# Altium schematic sheet ArbPwrBoost_P5.SchDoc: =ProjectTitle
size B; Engineer: Hab Collector; Organization: Altium Limited; Address1: 3621 Gin Way; Address2: Snellville, GA 30039; SheetNumber: 5; SheetTotal: 7
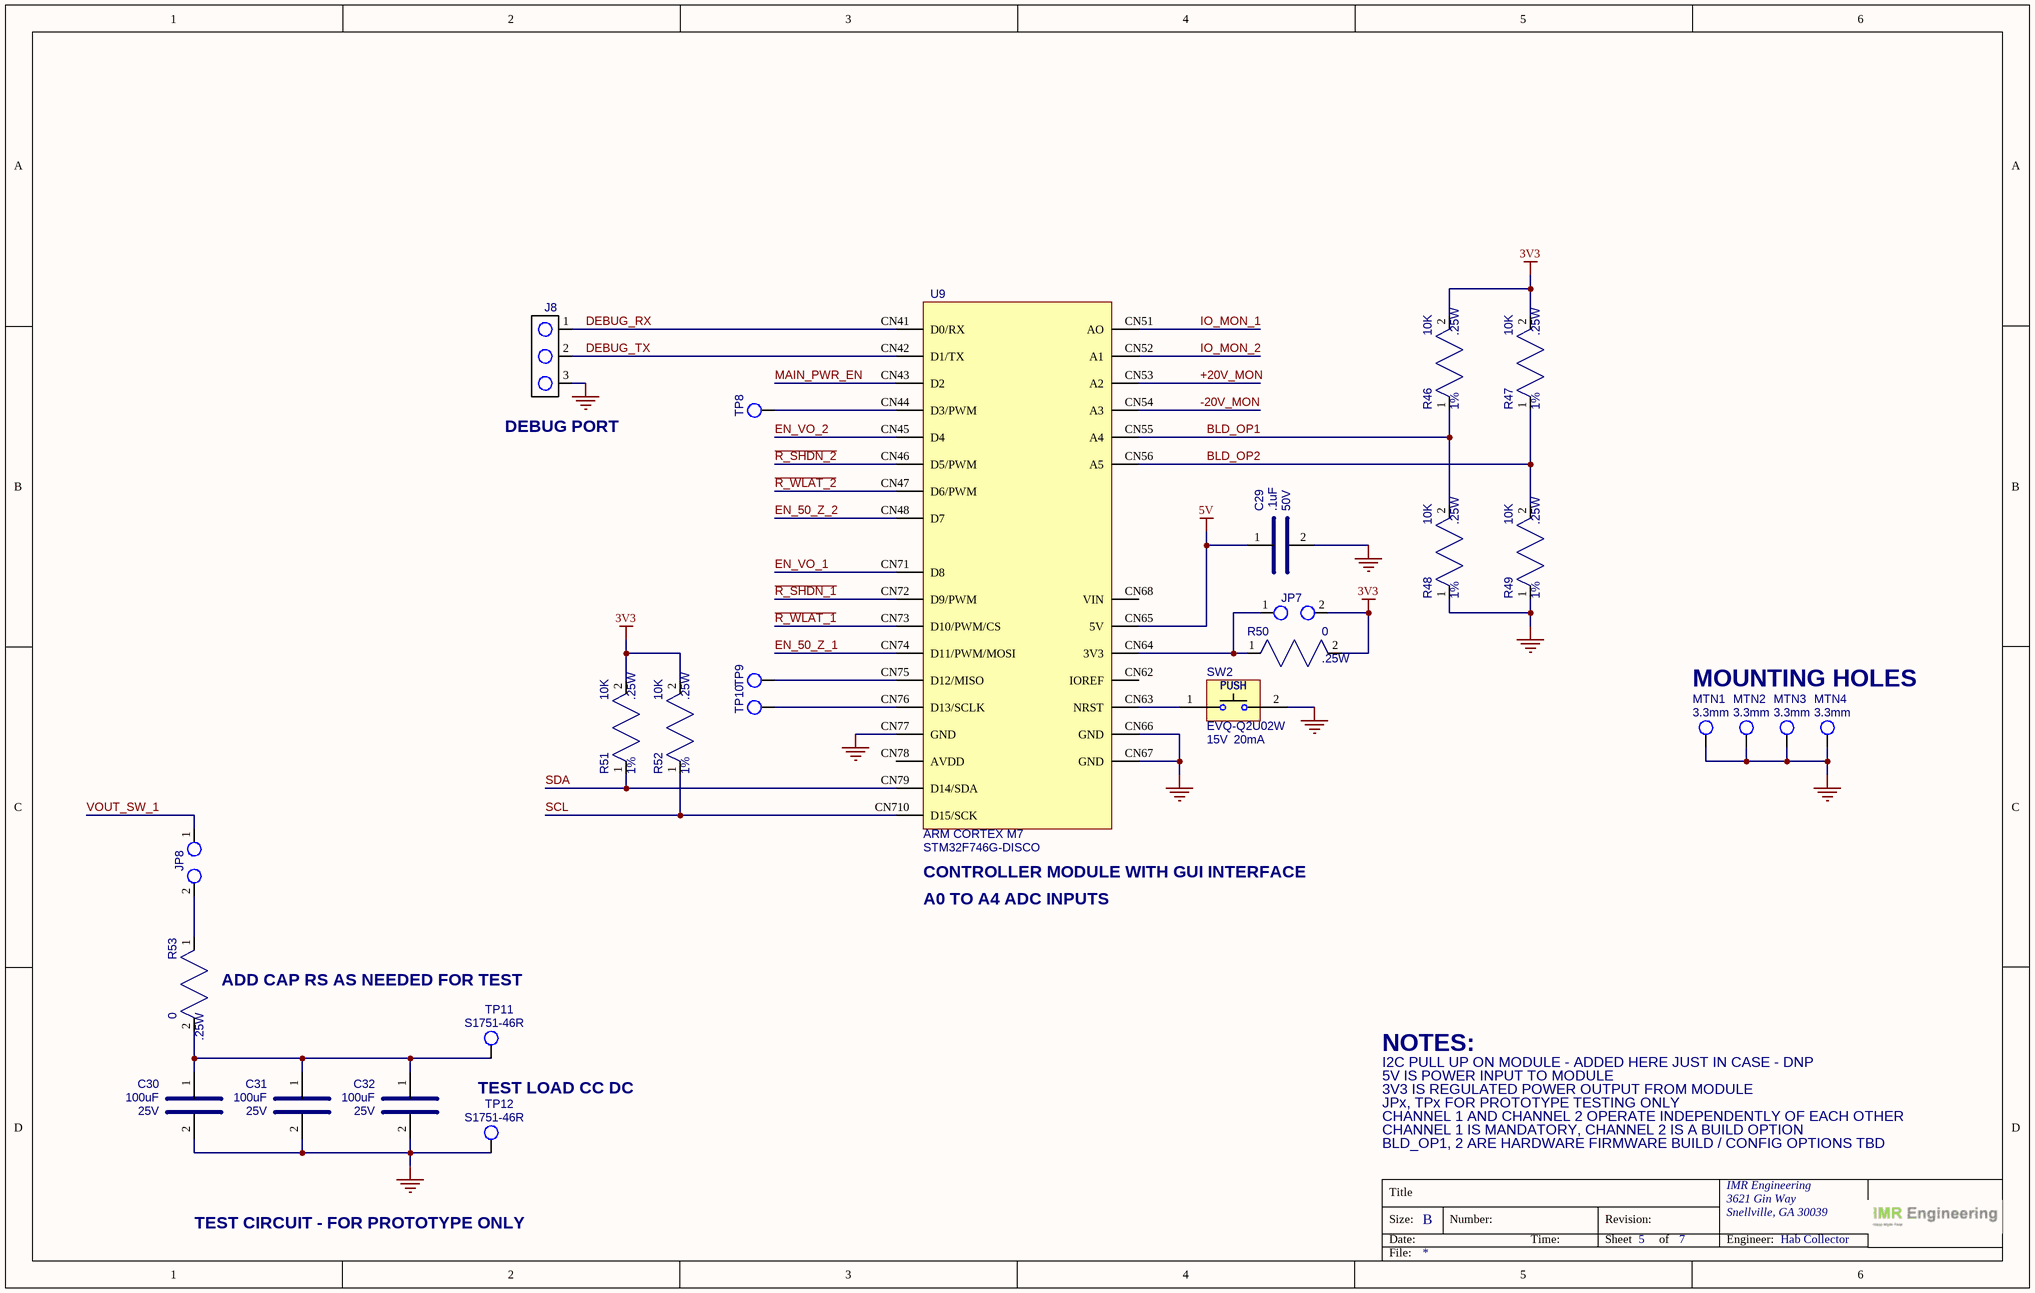
[diagram p0: ArbPwrBoost_P5.SchDoc]

## Parts
C29  value .1uF  Voltage: 50V  [CAP_0805]  (hidden comment: KGM21NR71H104KT)
C30  value 100uF  Voltage: 25V  [CAPC6153X670N]  (hidden comment: KCM55WC71E107MH13L)
C31  value 100uF  Voltage: 25V  [CAPC6153X670N]  (hidden comment: KCM55WC71E107MH13L)
C32  value 100uF  Voltage: 25V  [CAPC6153X670N]  (hidden comment: KCM55WC71E107MH13L)
J8  PREC003SFAN-RC  [HDR_1X3_100MILL]  (value not drawn)
JP7  PREC002SFAN-RC  [HDR_1X2_100MILL]  (value not drawn)
JP8  PREC002SFAN-RC  [HDR_1X2_100MILL]  (value not drawn)
MTN1  Hole Size: 3.3mm  [PMG_MT_HOLE_3.3MM]  (no BOM)
MTN2  Hole Size: 3.3mm  [PMG_MT_HOLE_3.3MM]  (no BOM)
MTN3  Hole Size: 3.3mm  [PMG_MT_HOLE_3.3MM]  (no BOM)
MTN4  Hole Size: 3.3mm  [PMG_MT_HOLE_3.3MM]  (no BOM)
R46  value 10K  Power: .25W  Tolerance: 1%  [RES_0805]  (hidden comment: RC0805FR-7W10KL)
R47  value 10K  Power: .25W  Tolerance: 1%  [RES_0805]  (hidden comment: RC0805FR-7W10KL)
R48  value 10K  Power: .25W  Tolerance: 1%  [RES_0805]  (hidden comment: RC0805FR-7W10KL)
R49  value 10K  Power: .25W  Tolerance: 1%  [RES_0805]  (hidden comment: RC0805FR-7W10KL)
R50  value 0  Power: .25W  [RES_0805]  (hidden comment: RC0805JR-070RL)
R51  value 10K  Power: .25W  Tolerance: 1%  [RES_0805]  (hidden comment: RC0805FR-7W10KL)
R52  value 10K  Power: .25W  Tolerance: 1%  [RES_0805]  (hidden comment: RC0805FR-7W10KL)
R53  value 0  Power: .25W  [RES_0805]  (hidden comment: RC0805JR-070RL)
SW2  value 15V  Current: 20mA  [PANASONIC_EVQ-Q2U02W]  (hidden comment: EVQ-Q2U02W)
TP8  (no value)  [TEST_POINT_20MIL_TH]  (no BOM)
TP9  (no value)  [TEST_POINT_20MIL_TH]  (no BOM)
TP10  (no value)  [TEST_POINT_20MIL_TH]  (no BOM)
TP11  S1751-46R  [HARWIN_S1751]
TP12  S1751-46R  [HARWIN_S1751]
U9  value ARM CORTEX M7  [STM32F746G-DISCO]  (hidden comment: STM32F746G-DISCO)

## Nets
3V3: JP7.2 R46.2 R47.2 R50.2 R51.2 R52.2
5V: C29.1 U9.CN65(5V)
GND: C29.2 C30.2 C31.2 C32.2 J8.3 MTN1.1 MTN2.1 MTN3.1 MTN4.1 R48.1 R49.1 SW2.2(B') TP12.1 U9.CN66(GND) U9.CN67(GND) U9.CN77(GND)
+20V_MON: U9.CN53(A2)
-20V_MON: U9.CN54(A3)
~{R_SHDN_1}: U9.CN72(D9/PWM)
~{R_SHDN_2}: U9.CN46(D5/PWM)
~{R_WLAT_1}: U9.CN73(D10/PWM/CS)
~{R_WLAT_2}: U9.CN47(D6/PWM)
BLD_OP1: R46.1 R48.2 U9.CN55(A4)
BLD_OP2: R47.1 R49.2 U9.CN56(A5)
DEBUG_RX: J8.1 U9.CN41(D0/RX)
DEBUG_TX: J8.2 U9.CN42(D1/TX)
EN_50_Z_1: U9.CN74(D11/PWM/MOSI)
EN_50_Z_2: U9.CN48(D7)
EN_VO_1: U9.CN71(D8)
EN_VO_2: U9.CN45(D4)
IO_MON_1: U9.CN51(AO)
IO_MON_2: U9.CN52(A1)
MAIN_PWR_EN: U9.CN43(D2)
SCL: R52.1 U9.CN710(D15/SCK)
SDA: R51.1 U9.CN79(D14/SDA)
VOUT_SW_1: JP8.1
NetC30_1: C30.1 C31.1 C32.1 R53.2 TP11.1
NetJP7_1: JP7.1 R50.1 U9.CN64(3V3)
NetJP8_2: JP8.2 R53.1
NetSW2_1: SW2.1(B) U9.CN63(NRST)
NetTP8_1: TP8.1 U9.CN44(D3/PWM)
NetTP9_1: TP9.1 U9.CN75(D12/MISO)
NetTP10_1: TP10.1 U9.CN76(D13/SCLK)

Not connected (* = marked no-connect by the designer): U9 CN62(IOREF) CN68(VIN) CN78(AVDD)

## Notes on the sheet
- (near J8) DEBUG PORT
- MOUNTING HOLES
- (near U9) CONTROLLER MODULE WITH GUI INTERFACE
- A0 TO A4 ADC INPUTS
- (near R53) ADD CAP RS AS NEEDED FOR TEST
- TEST LOAD CC DC
- I2C PULL UP ON MODULE - ADDED HERE JUST IN CASE - DNP
- NOTES:
- 5V IS POWER INPUT TO MODULE
- 3V3 IS REGULATED POWER OUTPUT FROM MODULE
- JPx, TPx FOR PROTOTYPE TESTING ONLY
- CHANNEL 1 IS MANDATORY, CHANNEL 2 IS A BUILD OPTION
- CHANNEL 1 AND CHANNEL 2 OPERATE INDEPENDENTLY OF EACH OTHER
- BLD_OP1, 2 ARE HARDWARE FIRMWARE BUILD / CONFIG OPTIONS TBD
- TEST CIRCUIT - FOR PROTOTYPE ONLY
- Title
- Size:
- Date:
- B
- Number:
- Time:
- Revision:
- Sheet
- of
- IMR Engineering
- Engineer:
- File:
- (in symbol SWITCH_EVQ-Q2U02W) PUSH

## Library data of the parts
C29 = CAP_SMD_0.1UF_50V_0805: CAP CER 0.1UF 50V X7R 0805; MFG: KYOCERA AVX; Case/Package: 0805; MFG_PN: KGM21NR71H104KT; Supplier 1: DigiKey; Supplier Part Number 1: 478-KGM21NR71H104KTCT-ND; Unit Price: .1
C30-C32 = CAP_SMD_100UF_25V_SMD: CAP CER 100UF 25V X7S SMD; MFG: Murata Electronics; Case/Package: CAPC6153X670N; MFG_PN: KCM55WC71E107MH13L; Supplier 1: DigiKey; Supplier Part Number 1: 490-KCM55WC71E107MH13LCT-ND; Unit Price: 5.68
J8 = CONN_HEADER_3P_100MIL_VERT: CONN HEADER VERT 3POS 2.54MM; MFG: Sullins Connector Solutions; Case/Package: 2P_2.54MM; MFG_PN: PREC003SFAN-RC; Supplier 1: Digi-Key; Supplier Part Number 1: S1212EC-03-ND; Value: *; Unit Price: .07
JP7 JP8 = CONN_JUMPER_2P_100MIL_VERT: CONN HEADER VERT 2POS 2.54MM; MFG: Sullins Connector Solutions; Case/Package: 2P_2.54MM; MFG_PN: PREC002SFAN-RC; Supplier 1: Digi-Key; Supplier Part Number 1: S1212EC-02-ND; Value: *; Unit Price: .07
MTN1-MTN4 = MTN_HOLE_3.3MM: MOUNTING HOLE 3.3MM
R46-R49 R51 R52 = RES_SMD_10K_0805_1/4W_1%: RES SMD 10K OHM 1% 1/4W 0805; MFG: Yageo; Case/Package: 0805; MFG_PN: RC0805FR-7W10KL; Supplier 1: DigiKey; Supplier Part Number 1: 13-RC0805FR-7W10KLCT-ND; Unit Price: .10
R50 R53 = RES_SMD_0_0805_1/8W_1%: RES SMD 0 OHM 1% 1/8W 0805; MFG: Yageo; Case/Package: 0805; MFG_PN: RC0805JR-070RL; Supplier 1: DigiKey; Supplier Part Number 1: 311-0.0ARCT-ND; Unit Price: .1; Tolerance: 1%
SW2 = SWITCH_EVQ-Q2U02W: SWITCH TACTILE SPST-NO 0.02A 15V; MFG: American Zettler; Case/Package: EVQQ2; Supplier 1: DigiKey; Supplier Part Number 1: P12954SCT-ND; Unit Price: .25; MFG_PN: EVQ-Q2U02W
TP8-TP10 = CONN_TEST_POINT_TH_PAD_20MIL: TEST POINT TH 20MIL HOLE
TP11 TP12 = CONN_TEST_POINT_S1751-46R: PCB TEST POINT CONNECT; MFG: Harwin Inc; Case/Package: S1751; MFG_PN: S1751-46R; Supplier 1: Digi-Key; Supplier Part Number 1: 952-1478-1-ND; Value: *; Unit Price: .28
U9 = MODULE_STM32F746G-DISCO: DISCOVERY STM32 F7 EVAL BRD; MFG: ST Microlectronics; Current: 2A; Case/Package: STM32F746G-DISCO; Supplier 1: DigiKey; Supplier Part Number 1: 497-15680-5-ND; Unit Price: 57.50; MFG_PN: STM32F746G-DISCO